# EAGLE schematic untitled (EAGLE 9.2.2)
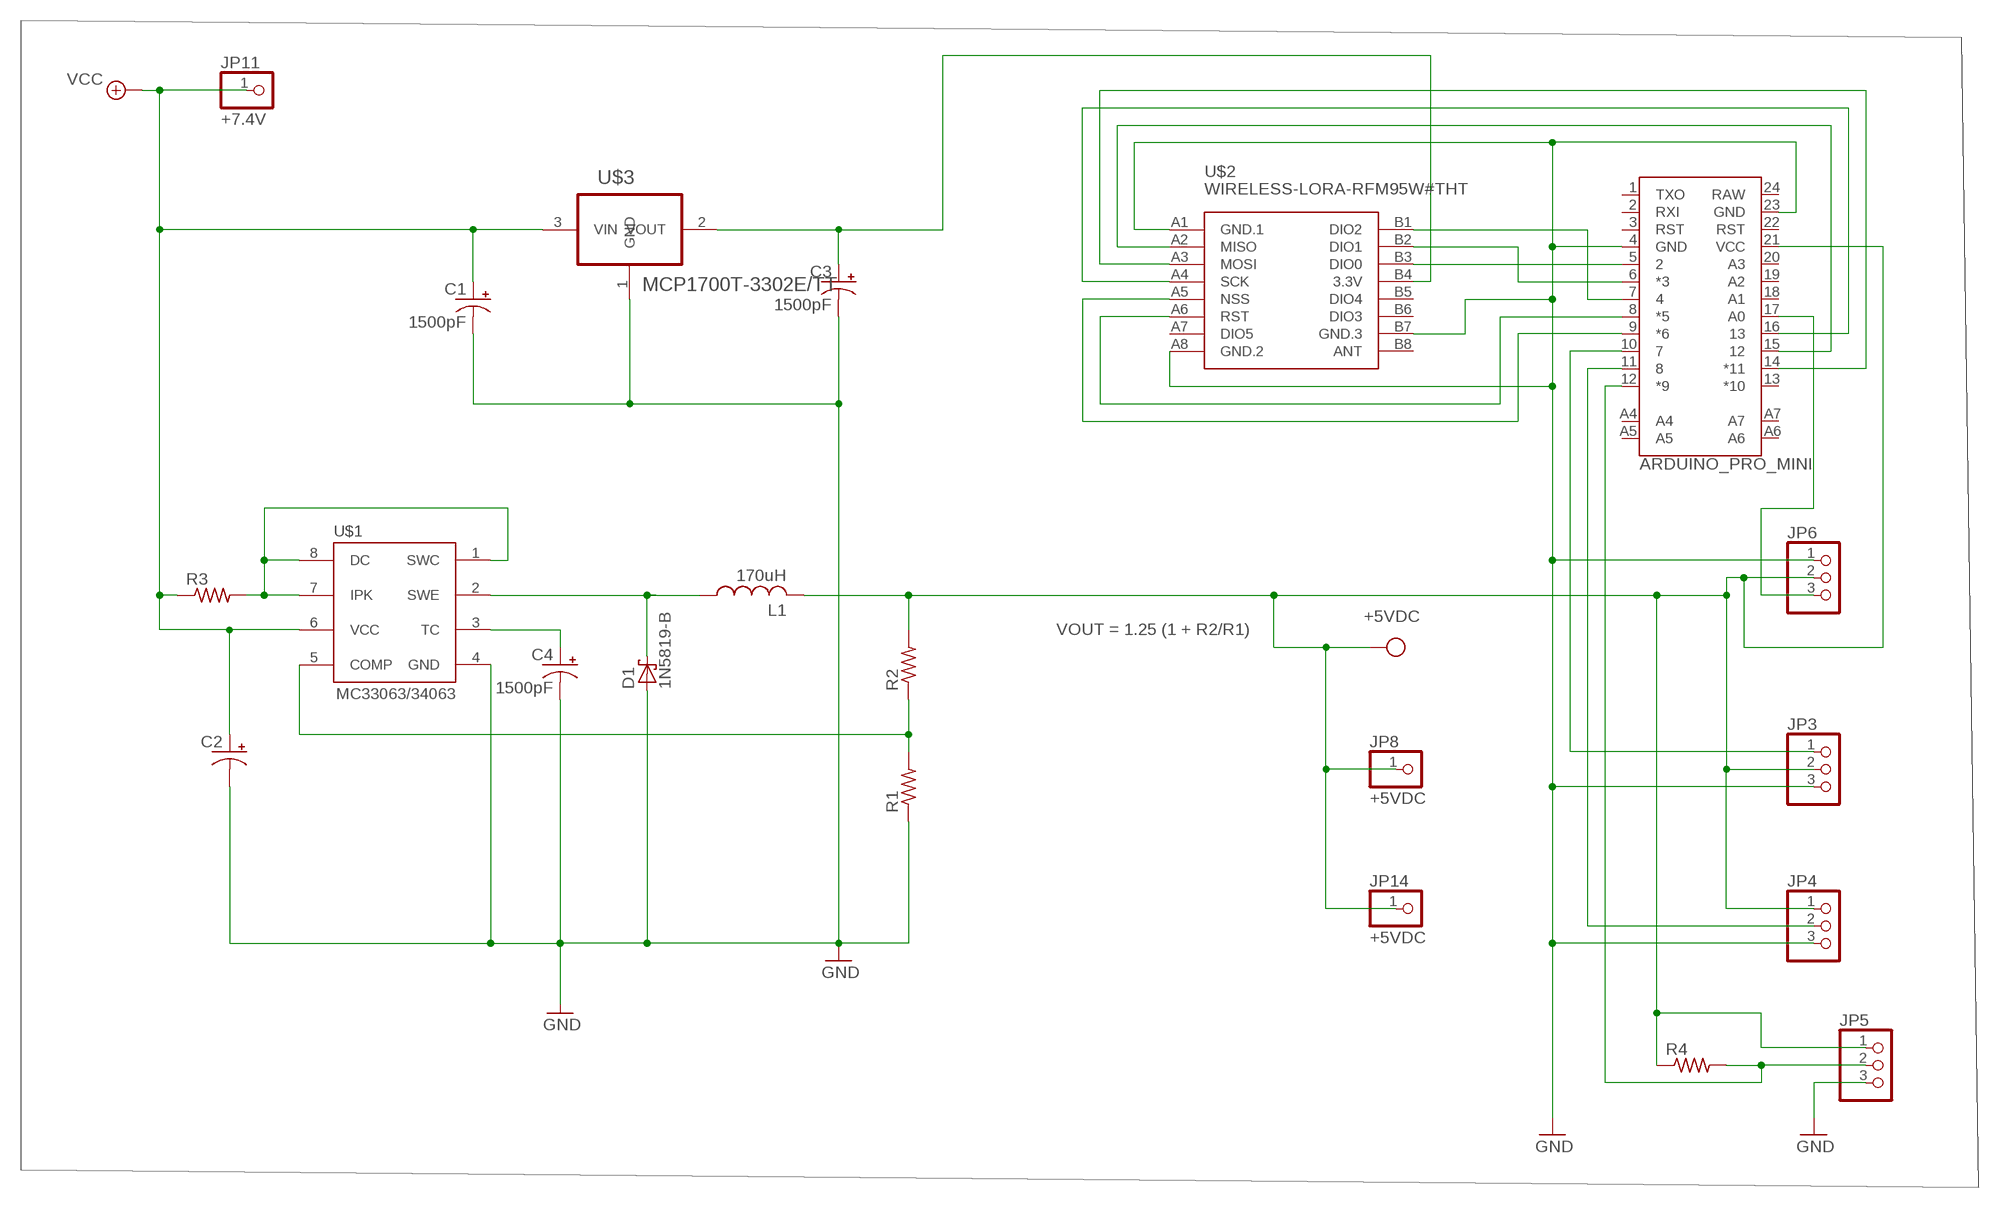
[diagram p0: schematic, sheet 1]

## Parts
B1  ARDUINO_PRO_MINI  [ARDUINO_PRO_MINI]
C1  1500pF  CPOL-USE2,5-6E  [E2,5-6E]
C2  100uF  CPOL-USE2,5-6E  [E2,5-6E]
C3  1500pF  CPOL-USE2,5-6E  [E2,5-6E]
C4  1500pF  CPOL-USE2,5-6E  [E2,5-6E]
D1  1N5819-B  [DO41-7.6]
JP3  PINHD-1X3CB  [1X03-CLEANBIG]
JP4  PINHD-1X3CB  [1X03-CLEANBIG]
JP5  PINHD-1X3CB  [1X03-CLEANBIG]
JP6  PINHD-1X3CB  [1X03-CLEANBIG]
JP8  +5VDC  PINHD-1X1  [1X01]
JP11  +7.4V  PINHD-1X1  [1X01]
JP14  +5VDC  PINHD-1X1  [1X01]
L1  170uH  L-US0207/12  [0207/12]
R1  R-US_0309/12  [0309/12]
R2  R-US_0309/12  [0309/12]
R3  R-US_0309/12  [0309/12]
R4  R-US_0309/12  [0309/12]
U$1  MC33063/MC34063P  [DIL08]
U$2  WIRELESS-LORA-RFM95W#THT  [WIRELESS-LORA-RFM95W#THT]
U$3  MCP1700T-3302E/TT  [SOT95P237X112-3N]

## Nets
+3.3V: C1.+ C2.+ JP11.1 R3.1 U$1.6(VCC) U$3.3(VIN) ; supply symbol labelled VCC
GND: B1.4(GND) B1.23(GND) C1.- C2.- C3.- C4.- D1.A JP3.3 JP4.3 JP5.3 JP6.1 R1.1 U$1.4(GND) U$2.A1(GND.1) U$2.A8(GND.2) U$2.B7(GND.3) U$3.1(GND)
N$1: B1.9(*6) U$2.A5(NSS)
N$2: B1.12(*9) JP5.2 R4.2
N$4: D1.C L1.1 U$1.2(SWE)
N$5: R3.2 U$1.1(SWC) U$1.7(IPK) U$1.8(DC)
N$6: B1.7 U$2.B1(DIO2)
N$7: B1.5 U$2.B3(DIO0)
N$8: B1.6(*3) U$2.B2(DIO1)
N$9: B1.8(*5) U$2.A6(RST)
N$10: B1.16 U$2.A4(SCK)
N$11: B1.14(*11) U$2.A3(MOSI)
N$12: B1.15 U$2.A2(MISO)
N$13: B1.11 JP4.2
N$14: R1.2 R2.1 U$1.5(COMP)
N$15: B1.10 JP3.1
N$16: B1.17(A0) JP6.3
N$17: C3.+ U$2.B4(3.3V) U$3.2(VOUT)
N$34: C4.+ U$1.3(TC)
VCC: B1.21(VCC) JP3.2 JP4.1 JP5.1 JP6.2 JP8.1 JP14.1 L1.2 R2.2 R4.1 ; supply symbol labelled +5VDC
Unconnected: B1.1(TXO) B1.2(RXI) B1.3(RST) B1.13(*10) B1.18(A1) B1.19(A2) B1.20(A3) B1.22(RST) B1.A4 B1.A5 B1.A6 B1.A7 U$2.A7(DIO5) U$2.B5(DIO4) U$2.B6(DIO3) U$2.B8(ANT)

## Notes on the sheet
- VOUT = 1.25 (1 + R2/R1)

## Power pins joined to a net without a drawn wire
RAW: B1.24(RAW)

## Library data of the parts
B1 = SparkFun-Boards:ARDUINO_PRO_MINI: SparkFun Pro Mini Pro Mini compatible footprint. Dimensions: 0.7 x 1.3" PCB Thickness: 0.8mm SparkFun Products: 3.3V/8MHz <https://www.sparkfun.com/products/11114> 5V/16MHz <https://www.sparkfun.com/products/11113>
C1-C4 = rcl:CPOL-US: POLARIZED CAPACITOR, American symbol; SPICEPREFIX: C
D1 = diode:1N581*: 1.0A SCHOTTKY BARRIER RECTIFIER Source: http://www.diodes.com/datasheets/ds23001.pdf
JP3-JP6 = adafruit:PINHD-1X3: PIN HEADER
JP8 JP11 JP14 = adafruit:PINHD-1X1: Pin header 1x1 for 0.1" spacing With round pins
L1 = rcl:L-US: INDUCTOR, American symbol; SPICEPREFIX: L
R1-R4 = adafruit:R-US_: RESISTOR, American symbol
U$1 = adafruit:MC33063/MC34063: MC33063 and MC34063 Basic DC/DC converter with internal power-NPN transistor, 100KHz, 1.5A peak switch current. 3-40 input/output.
U$2 = diy-modules:WIRELESS-LORA-RFM95W: 868/915 MHz LoRa Radio Transceiver Module based on SX1276 chip Click here to find device on ebay.com <http://www.ebay.com/sch/RFM95W+transceiver>
U$3 = MCP1700T-3302E_TT:MCP1700T-3302E/TT: Low Quiescent Current LDO; AVAILABILITY: Unavailable; DESCRIPTION: MCP1700 Series 250 mA 3.3 V Fixed Output LDO Voltage Regulator - SOT-23; MF: Microchip; MP: MCP1700T-3302E/TT; PACKAGE: SOT-23-3 Microchip; PRICE: None